# EAGLE design Battery Characterizer (EAGLE 7.7.0)
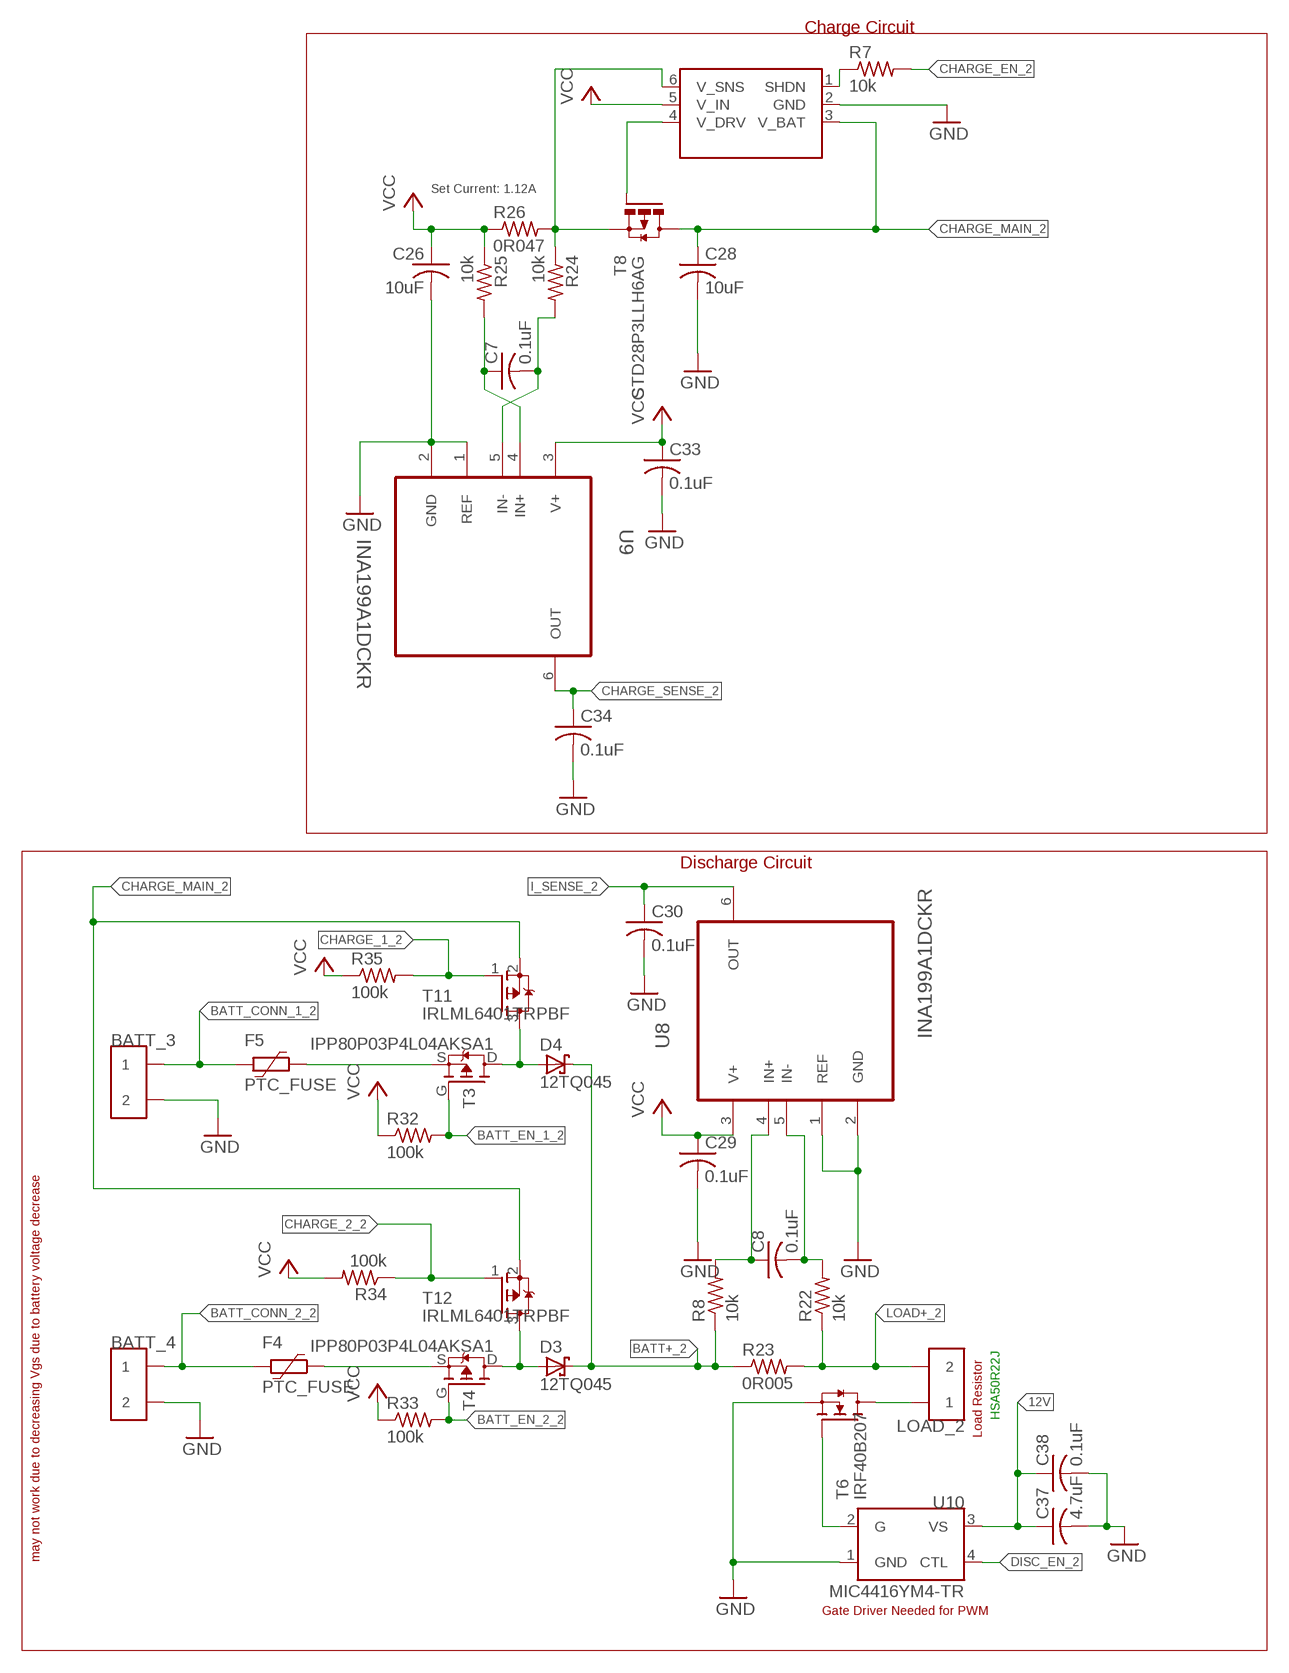
[diagram p0: schematic, sheet 1, part 1 of 2]
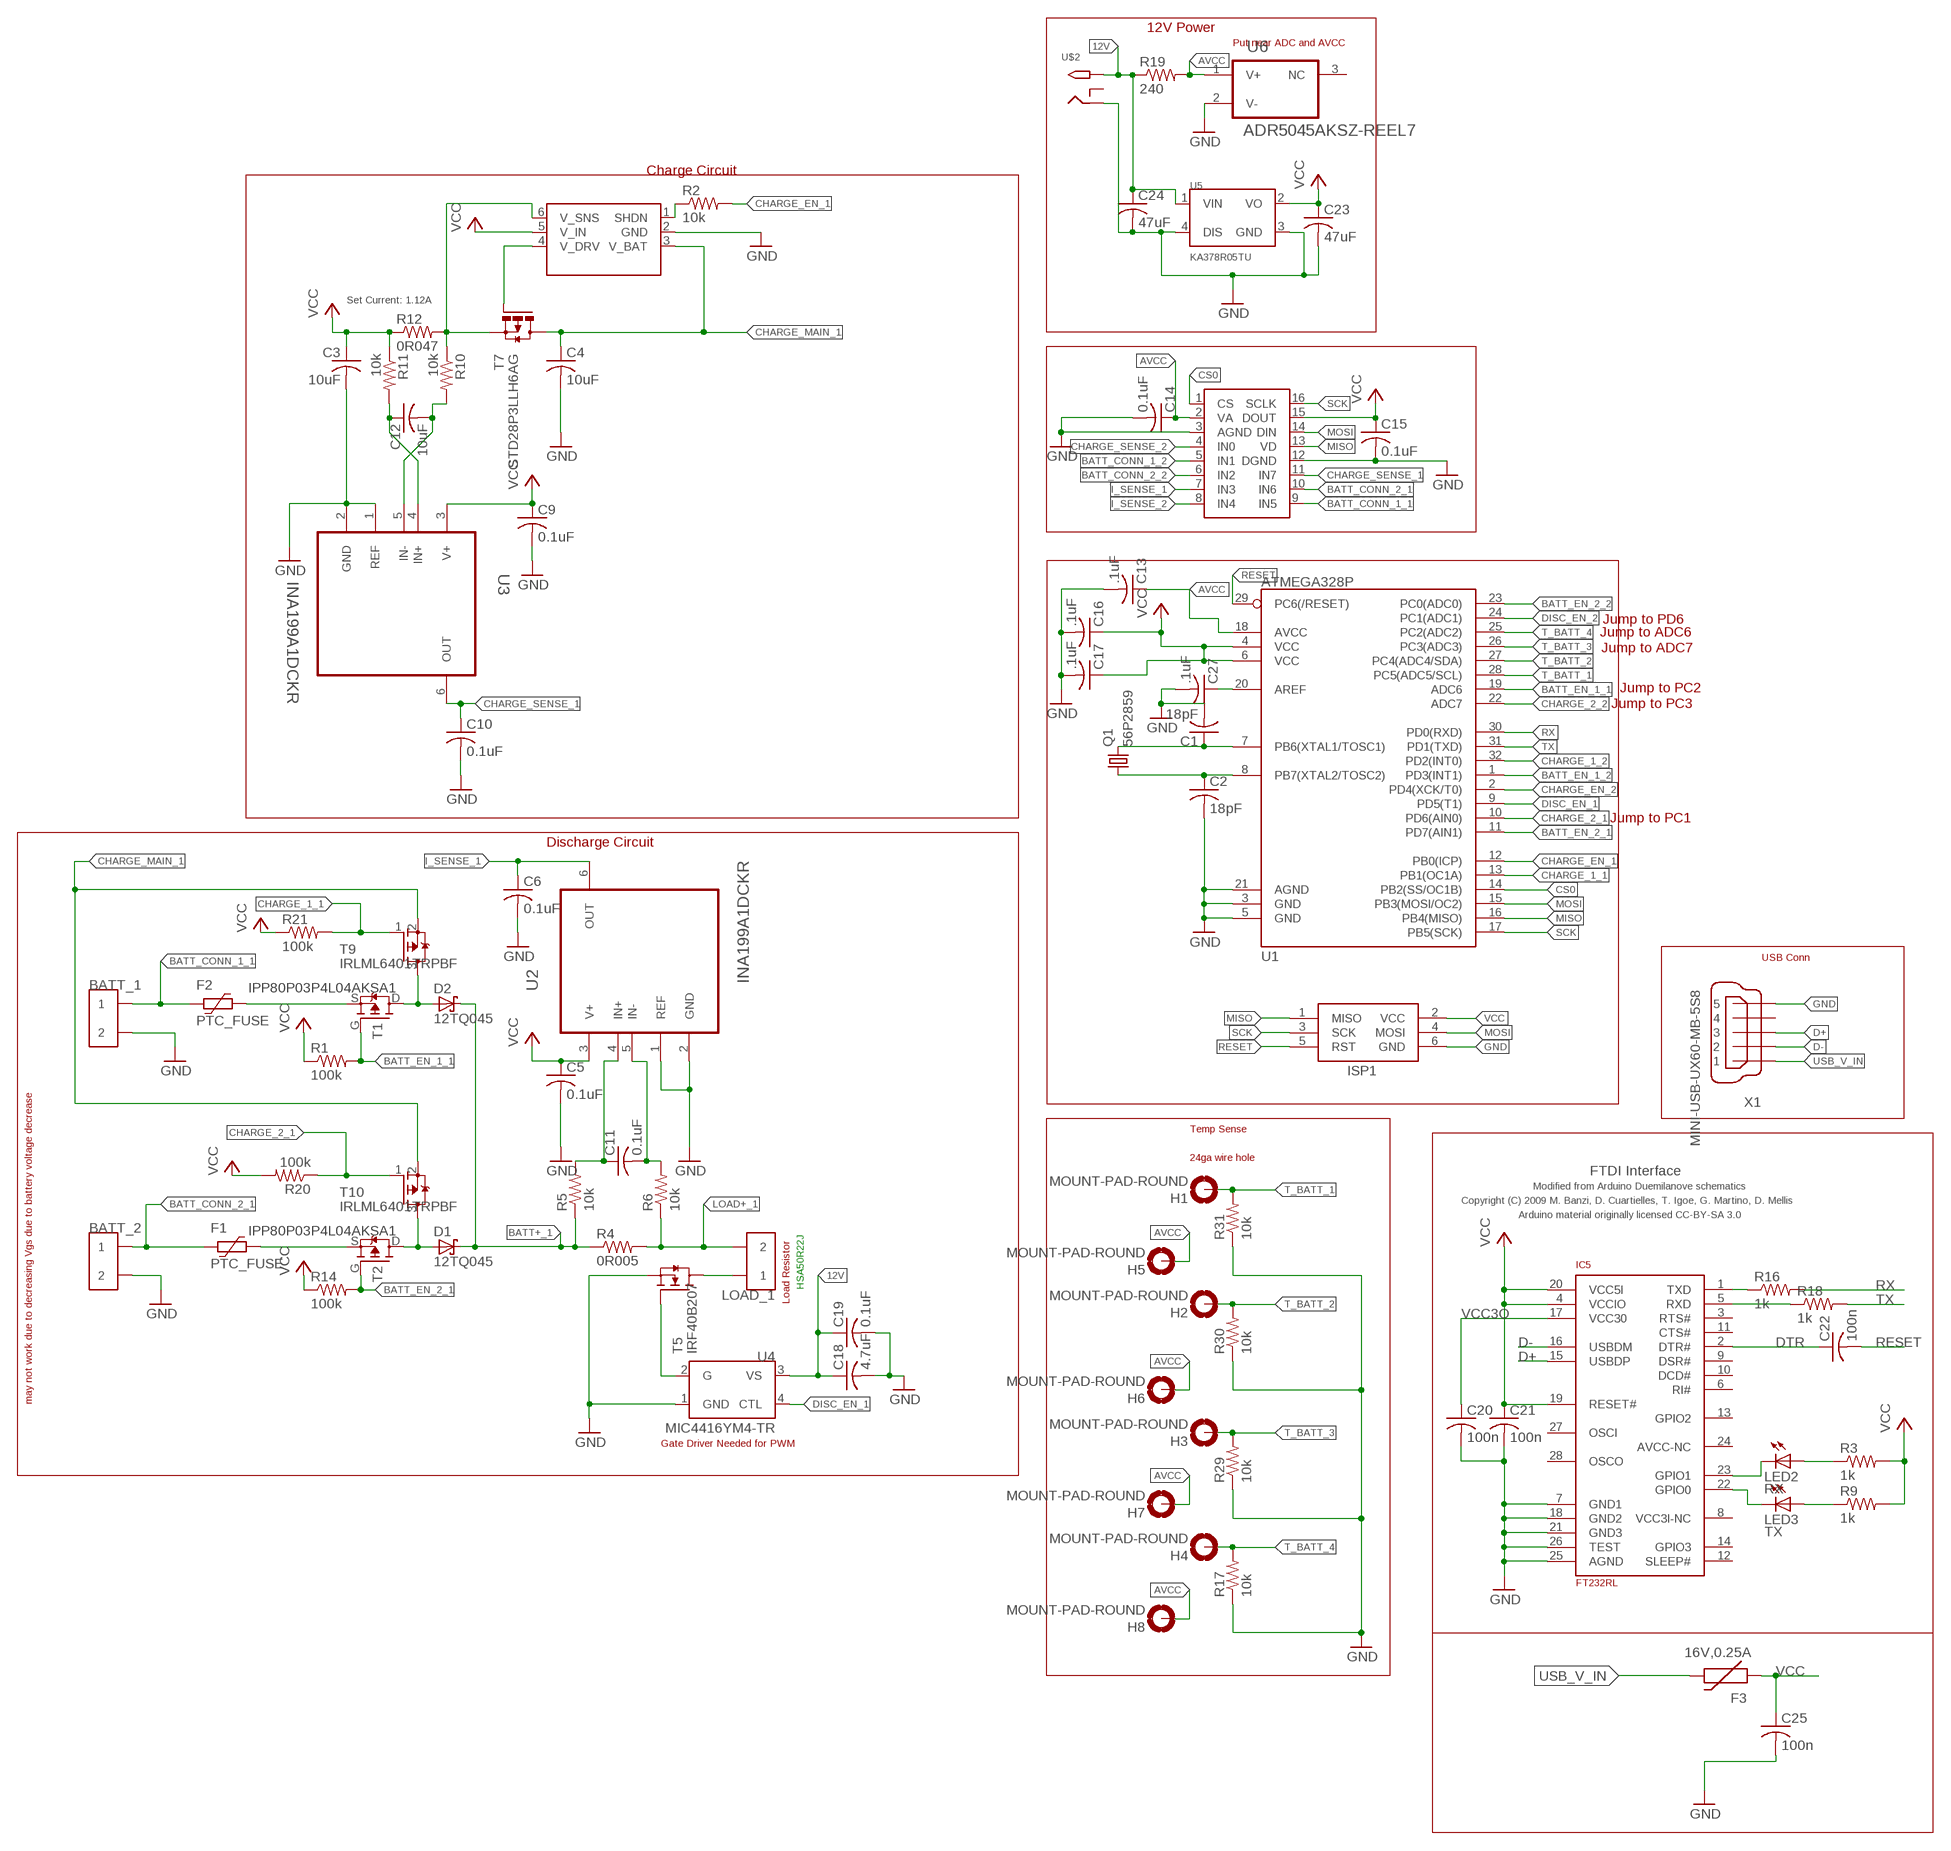
[diagram p1: schematic, sheet 1, part 2 of 2]

## Parts
BATT_1  CONN_2  [CONNECTOR_2]
BATT_2  CONN_2  [CONNECTOR_2]
BATT_3  CONN_2  [CONNECTOR_2]
BATT_4  CONN_2  [CONNECTOR_2]
C1  18pF  C-USC0805  [C0805]
C2  18pF  C-USC0805  [C0805]
C3  10uF  C-USC0603  [C0603]
C4  10uF  C-USC0603  [C0603]
C5  0.1uF  C-USC0603  [C0603]
C6  0.1uF  C-USC0603  [C0603]
C7  0.1uF  C-USC0603  [C0603]
C8  0.1uF  C-USC0603  [C0603]
C9  0.1uF  C-USC0603  [C0603]
C10  0.1uF  C-USC0603  [C0603]
C11  0.1uF  C-USC0603  [C0603]
C12  10uF  C-USC0603  [C0603]
C13  .1uF  C-USC0603  [C0603]
C14  0.1uF  C-USC0603  [C0603]
C15  0.1uF  C-USC0603  [C0603]
C16  .1uF  C-USC0603  [C0603]
C17  .1uF  C-USC0603  [C0603]
C18  4.7uF  C-USC0805  [C0805]
C19  0.1uF  C-USC0603  [C0603]
C20  100n  C-USC0805  [C0805]
C21  100n  C-USC0805  [C0805]
C22  100n  C-USC0805  [C0805]
C23  47uF  C-USC0805  [C0805]
C24  47uF  C-USC0805  [C0805]
C25  100n  C-USC0805  [C0805]
C26  10uF  C-USC0603  [C0603]
C27  .1uF  C-USC0603  [C0603]
C28  10uF  C-USC0603  [C0603]
C29  0.1uF  C-USC0603  [C0603]
C30  0.1uF  C-USC0603  [C0603]
C33  0.1uF  C-USC0603  [C0603]
C34  0.1uF  C-USC0603  [C0603]
C37  4.7uF  C-USC0805  [C0805]
C38  0.1uF  C-USC0603  [C0603]
D1  12TQ045  [TO220-2]
D2  12TQ045  [TO220-2]
D3  12TQ045  [TO220-2]
D4  12TQ045  [TO220-2]
F1  PTC_FUSE  [RGEF1100]
F2  PTC_FUSE  [RGEF1100]
F3  16V,0.25A  PTCSMD  [PTC-1206]
F4  PTC_FUSE  [RGEF1100]
F5  PTC_FUSE  [RGEF1100]
H1  MOUNT-PAD-ROUND  [032-PAD]
H2  MOUNT-PAD-ROUND  [032-PAD]
H3  MOUNT-PAD-ROUND  [032-PAD]
H4  MOUNT-PAD-ROUND  [032-PAD]
H5  MOUNT-PAD-ROUND  [032-PAD]
H6  MOUNT-PAD-ROUND  [032-PAD]
H7  MOUNT-PAD-ROUND  [032-PAD]
H8  MOUNT-PAD-ROUND  [032-PAD]
IC5  FT232RL  [SSOP28]
ISP1  AVRISP-6  [AVRISP]
LED2  RX  LEDCHIPLED_0805  [CHIPLED_0805]
LED3  TX  LEDCHIPLED_0805  [CHIPLED_0805]
LOAD_1  CONN_2  [CONNECTOR_2]
LOAD_2  CONN_2  [CONNECTOR_2]
PC1  MCP73826  [SOT23-6]
PC2  MCP73826  [SOT23-6]
Q1  56P2859  CRYSTALSMD  [HC49UP]
R1  100k  R-US_M0805  [M0805]
R2  10k  R-US_R0603  [R0603]
R3  1k  R-US_R0805  [R0805]
R4  0R005  WSL3637  [R-3637]
R5  10k  R-US_R0603  [R0603]
R6  10k  R-US_R0603  [R0603]
R7  10k  R-US_R0603  [R0603]
R8  10k  R-US_R0603  [R0603]
R9  1k  R-US_R0805  [R0805]
R10  10k  R-US_R0603  [R0603]
R11  10k  R-US_R0603  [R0603]
R12  0R047  R-US_M1206  [M1206]
R14  100k  R-US_M0805  [M0805]
R16  1k  R-US_R0805  [R0805]
R17  10k  R-US_R0603  [R0603]
R18  1k  R-US_R0805  [R0805]
R19  240  R-US_R0603  [R0603]
R20  100k  R-US_M0805  [M0805]
R21  100k  R-US_M0805  [M0805]
R22  10k  R-US_R0603  [R0603]
R23  0R005  WSL3637  [R-3637]
R24  10k  R-US_R0603  [R0603]
R25  10k  R-US_R0603  [R0603]
R26  0R047  R-US_M1206  [M1206]
R29  10k  R-US_R0603  [R0603]
R30  10k  R-US_R0603  [R0603]
R31  10k  R-US_R0603  [R0603]
R32  100k  R-US_M0805  [M0805]
R33  100k  R-US_M0805  [M0805]
R34  100k  R-US_M0805  [M0805]
R35  100k  R-US_M0805  [M0805]
T1  IPP80P03P4L04AKSA1  [TO220-3]
T2  IPP80P03P4L04AKSA1  [TO220-3]
T3  IPP80P03P4L04AKSA1  [TO220-3]
T4  IPP80P03P4L04AKSA1  [TO220-3]
T5  IRF40B207  [TO220-3]
T6  IRF40B207  [TO220-3]
T7  STD28P3LLH6AG  [D2-PAK]
T8  STD28P3LLH6AG  [D2-PAK]
T9  IRLML6401TRPBF  [SOT95P237X112-3N]
T10  IRLML6401TRPBF  [SOT95P237X112-3N]
T11  IRLML6401TRPBF  [SOT95P237X112-3N]
T12  IRLML6401TRPBF  [SOT95P237X112-3N]
U1  ATMEGA328P  ATMEGA328_SMT  [TQFP32-08]
U2  INA199A1DCKR  [SOT65P210X110-6N]
U3  INA199A1DCKR  [SOT65P210X110-6N]
U4  MIC4416YM4-TR  [4-SOT_143]
U5  KA378R05TU  [TO-220-4]
U6  ADR5045AKSZ-REEL7  ADR5041BRTZ-R2  [SOT95P237X112-3N]
U8  INA199A1DCKR  [SOT65P210X110-6N]
U9  INA199A1DCKR  [SOT65P210X110-6N]
U10  MIC4416YM4-TR  [4-SOT_143]
U$2  2.1MMJACKTHM  [PJ-102A]
U$7  ADC128S022CIMTX/NOPB  [TSSOP16]
X1  MINI-USB-UX60-MB-5S8  [UX60-MB-5S8]

## Nets
12V: C18.1 C19.1 C24.1 C37.1 C38.1 R19.1 U4.3(VS) U5.1(VIN) U10.3(VS) U$2.TIP
AREF: C27.1 U1.20(AREF)
AVCC: C13.1 C14.1 H5.1(MOUNT) H6.1(MOUNT) H7.1(MOUNT) H8.1(MOUNT) R19.2 U1.18(AVCC) U6.1(V+) U$7.2(VA)
BATT+_1: D1.C D2.C R4.1 R4.2 R5.1
BATT+_2: D3.C D4.C R8.1 R23.1 R23.2
BATT_CONN_1_1: BATT_1.1 BATT_1.2 F2.P$2 U$7.9(IN5)
BATT_CONN_1_2: BATT_3.1 BATT_3.2 F5.P$2 U$7.5(IN1)
BATT_CONN_2_1: BATT_2.1 BATT_2.2 F1.P$2 U$7.10(IN6)
BATT_CONN_2_2: BATT_4.1 BATT_4.2 F4.P$2 U$7.6(IN2)
BATT_EN_1_1: R1.2 T1.G U1.19(ADC6)
BATT_EN_1_2: R32.2 T3.G U1.1(PD3(INT1))
BATT_EN_2_1: R14.2 T2.G U1.11(PD7(AIN1))
BATT_EN_2_2: R33.2 T4.G U1.23(PC0(ADC0))
CHARGE_1_1: R21.2 T9.1(G) U1.13(PB1(OC1A))
CHARGE_1_2: R35.2 T11.1(G) U1.32(PD2(INT0))
CHARGE_2_1: R20.1 T10.1(G) U1.10(PD6(AIN0))
CHARGE_2_2: R34.1 T12.1(G) U1.22(ADC7)
CHARGE_EN_1: R2.2 U1.12(PB0(ICP))
CHARGE_EN_2: R7.2 U1.2(PD4(XCK/T0))
CHARGE_MAIN_1: C4.1 PC1.3(V_BAT) T7.2(D) T7.P$1(D) T7.P$2(D) T7.P$3(D) T7.P$4(D) T7.P$5(D) T7.P$6(D) T7.P$7(D) T7.P$8(D) T7.P$9(D) T7.P$10(D) T7.P$11(D) T7.P$12(D) T7.P$13(D) T7.P$14(D) T7.P$15(D) T7.P$16(D) T7.P$17(D) T7.P$18(D) T7.P$19(D) T7.P$20(D) T7.P$21(D) T7.P$22(D) T7.P$23(D) T7.P$24(D) T7.P$25(D) T7.P$26(D) T7.P$27(D) T7.P$28(D) T7.P$29(D) T7.P$30(D) T9.2(S) T10.2(S)
CHARGE_MAIN_2: C28.1 PC2.3(V_BAT) T8.2(D) T8.P$1(D) T8.P$2(D) T8.P$3(D) T8.P$4(D) T8.P$5(D) T8.P$6(D) T8.P$7(D) T8.P$8(D) T8.P$9(D) T8.P$10(D) T8.P$11(D) T8.P$12(D) T8.P$13(D) T8.P$14(D) T8.P$15(D) T8.P$16(D) T8.P$17(D) T8.P$18(D) T8.P$19(D) T8.P$20(D) T8.P$21(D) T8.P$22(D) T8.P$23(D) T8.P$24(D) T8.P$25(D) T8.P$26(D) T8.P$27(D) T8.P$28(D) T8.P$29(D) T8.P$30(D) T11.2(S) T12.2(S)
CHARGE_SENSE_1: C10.1 U3.6(OUT) U$7.11(IN7)
CHARGE_SENSE_2: C34.1 U9.6(OUT) U$7.4(IN0)
CS0: U1.14(PB2(SS/OC1B)) U$7.1(CS)
D+: IC5.15(USBDP) X1.3
D-: IC5.16(USBDM) X1.2
DISC_EN_1: U1.9(PD5(T1)) U4.4(CTL)
DISC_EN_2: U1.24(PC1(ADC1)) U10.4(CTL)
DISC_GATE_1: T5.G U4.2(G)
DISC_GATE_2: T6.G U10.2(G)
DISC_INV_1: C11.2 R6.2 U2.5(IN-)
DISC_INV_2: C8.2 R22.2 U8.5(IN-)
DISC_NON_INV_1: C11.1 R5.2 U2.4(IN+)
DISC_NON_INV_2: C8.1 R8.2 U8.4(IN+)
DTR: C22.1 IC5.2(DTR#)
FUSE_OUT_1_1: F2.P$1 T1.S
FUSE_OUT_1_2: F5.P$1 T3.S
FUSE_OUT_2_1: F1.P$1 T2.S
FUSE_OUT_2_2: F4.P$1 T4.S
GATE_1: PC1.4(V_DRV) T7.1(G)
GATE_2: PC2.4(V_DRV) T8.1(G)
GND: BATT_1.3 BATT_1.4 BATT_2.3 BATT_2.4 BATT_3.3 BATT_3.4 BATT_4.3 BATT_4.4 C1.2 C2.2 C3.2 C4.2 C5.2 C6.2 C9.2 C10.2 C13.2 C14.2 C15.2 C16.2 C17.2 C18.2 C19.2 C20.2 C21.2 C23.2 C24.2 C25.2 C26.2 C27.2 C28.2 C29.2 C30.2 C33.2 C34.2 C37.2 C38.2 IC5.7(GND1) IC5.18(GND2) IC5.21(GND3) IC5.25(AGND) IC5.26(TEST) ISP1.6(GND) PC1.2(GND) PC2.2(GND) R17.1 R29.1 R30.1 R31.1 T5.S T6.S U1.3(GND) U1.5(GND) U1.21(AGND) U2.1(REF) U2.2(GND) U3.1(REF) U3.2(GND) U4.1(GND) U5.3(GND) U5.4(DIS) U6.2(V-) U8.1(REF) U8.2(GND) U9.1(REF) U9.2(GND) U10.1(GND) U$2.RING U$7.3(AGND) U$7.12(DGND) X1.5 X1.M1 X1.M2 X1.M3 X1.M4
I_SENSE_1: C6.1 U2.6(OUT) U$7.7(IN3)
I_SENSE_2: C30.1 U8.6(OUT) U$7.8(IN4)
INV_1: C12.2 R10.2 U3.5(IN-)
INV_2: C7.2 R24.2 U9.5(IN-)
LOAD+_1: LOAD_1.3 LOAD_1.4 R4.3 R4.4 R6.1
LOAD+_2: LOAD_2.3 LOAD_2.4 R22.1 R23.3 R23.4
M8RXD: IC5.1(TXD) R16.1
M8TXD: IC5.5(RXD) R18.1
MISO: ISP1.1(MISO) U1.16(PB4(MISO)) U$7.13(VD)
MOSI: ISP1.4(MOSI) U1.15(PB3(MOSI/OC2)) U$7.14(DIN)
N$32: IC5.23(GPIO1) LED2.C
N$34: IC5.22(GPIO0) LED3.C
N$35: LED2.A R3.1
N$36: LED3.A R9.1
NMOS_IN_1: LOAD_1.1 LOAD_1.2 T5.D
NMOS_IN_2: LOAD_2.1 LOAD_2.2 T6.D
NON_INV_1: C12.1 R11.2 U3.4(IN+)
NON_INV_2: C7.1 R25.2 U9.4(IN+)
PMOS_OUT_1_1: D2.A T1.D T9.3(D)
PMOS_OUT_1_2: D4.A T3.D T11.3(D)
PMOS_OUT_2_1: D1.A T2.D T10.3(D)
PMOS_OUT_2_2: D3.A T4.D T12.3(D)
RESET: C22.2 ISP1.5(RST) U1.29(PC6(/RESET))
RX: R16.2 U1.30(PD0(RXD))
SCK: ISP1.3(SCK) U1.17(PB5(SCK)) U$7.16(SCLK)
SHDN_1: PC1.1(SHDN) R2.1
SHDN_2: PC2.1(SHDN) R7.1
T_BATT_1: H1.1(MOUNT) R31.2 U1.28(PC5(ADC5/SCL))
T_BATT_2: H2.1(MOUNT) R30.2 U1.27(PC4(ADC4/SDA))
T_BATT_3: H3.1(MOUNT) R29.2 U1.26(PC3(ADC3))
T_BATT_4: H4.1(MOUNT) R17.2 U1.25(PC2(ADC2))
TX: R18.2 U1.31(PD1(TXD))
USB_V_IN: F3.2 X1.1
V_SNS_1: PC1.6(V_SNS) R10.1 R12.2 T7.3(S)
V_SNS_2: PC2.6(V_SNS) R24.1 R26.2 T8.3(S)
VCC: C3.1 C5.1 C9.1 C15.1 C16.1 C17.1 C21.1 C23.1 C25.1 C26.1 C29.1 C33.1 F3.1 IC5.4(VCCIO) IC5.19(RESET#) IC5.20(VCC5I) ISP1.2(VCC) PC1.5(V_IN) PC2.5(V_IN) R1.1 R3.2 R9.2 R11.1 R12.1 R14.1 R20.2 R21.1 R25.1 R26.1 R32.1 R33.1 R34.2 R35.1 U1.4(VCC) U1.6(VCC) U2.3(V+) U3.3(V+) U5.2(VO) U8.3(V+) U9.3(V+) U$7.15(DOUT)
VCC3O: C20.1 IC5.17(VCC30)
XTAL1: C1.1 Q1.2 U1.7(PB6(XTAL1/TOSC1))
XTAL2: C2.1 Q1.1 U1.8(PB7(XTAL2/TOSC2))
Unconnected: IC5.3(RTS#) IC5.6(RI#) IC5.8(VCC3I-NC) IC5.9(DSR#) IC5.10(DCD#) IC5.11(CTS#) IC5.12(SLEEP#) IC5.13(GPIO2) IC5.14(GPIO3) IC5.24(AVCC-NC) IC5.27(OSCI) IC5.28(OSCO) U6.3(NC) U$2.RING_SW X1.4

## Notes on the sheet
- 12V Power
- Put near ADC and AVCC
- Charge Circuit | Charge Circuit
- Set Current: 1.12A | Set Current: 1.12A
- Jump to PD6
- Jump to ADC6
- Jump to ADC7
- Jump to PC2
- Jump to PC3
- Jump to PC1
- Discharge Circuit | Discharge Circuit
- USB Conn
- Temp Sense
- 24ga wire hole
- FTDI Interface
- Modified from Arduino Duemilanove schematics
- Copyright (C) 2009 M. Banzi, D. Cuartielles, T. Igoe, G. Martino, D. Mellis
- Arduino material originally licensed CC-BY-SA 3.0
- HSA50R22J | HSA50R22J
- Load Resistor | Load Resistor
- may not work due to decreasing Vgs due to battery voltage decrease | may not work due to decreasing Vgs due to battery voltage decrease
- Gate Driver Needed for PWM | Gate Driver Needed for PWM

## Library data of the parts
BATT_1-BATT_4 LOAD_1 LOAD_2 = formula electric:CONN_2; PN: A104554-ND
C1-C22 C25-C30 C33 C34 C37 C38 = rcl:C-US: CAPACITOR, American symbol
C23 = resistor:C-US: CAPACITOR, American symbol; PN: GRM21BR60J476ME15L
C24 = rcl:C-US: CAPACITOR, American symbol; PN: GRM21BR60J476ME15L
D1-D4 = SMC_Diode:12TQ045: Schottky Diode
F1 F2 F4 F5 = LittleFuse:PTC_FUSE: Polyfuse Resettable PTC Source: http://www.littelfuse.com/products/resettable-ptcs.aspx
F3 = SparkFun:PTC: Resettable Fuse PTC Resettable Fuse. Spark Fun Electronics SKU : COM-08357
H1-H8 = holes:MOUNT-PAD-ROUND: MOUNTING PAD, round
IC5 = SmartPrj:FT232RL
ISP1 = adafruit:AVRISP: AVR ISP HEADER Standard 6 pin header for AVR programming
LED2 LED3 = led:LED: LED OSRAM: - CHIPLED LG R971, LG N971, LY N971, LG Q971, LY Q971, LO R971, LY R971 LH N974, LH R974 LS Q976, LO Q976, LY Q976 LO Q996 - Hyper CHIPLED LW Q18S LB Q993, LB Q99A, LB R99A - SideLED LS A670, LO A670, LY A670, LG A670, LP A670 LB A673, LV A673, LT A673, LW A673 LH A674 LY A675 LS A676, LA A676, LO A676, LY A676, LW A676 LS A679, LY A679, LG A679 - Hyper Micro SIDELED® LS Y876, LA Y876, LO Y876, LY Y876 LT Y87S - SmartLED LW L88C, LW L88S LB L89C, LB L89S, LG L890 LS L89K, LO L89K, LY L89K LS L896, LA L896, LO L896, LY L896 - TOPLED LS T670, LO T670, LY T670, LG T670, LP T670 LSG T670, LSP T670, LSY T670, LOP T670, LYG T670 LG T671, LOG T671, LSG T671 LB T673, LV T673, LT T673, LW T673 LH T674 LS T676, LA T676, LO T676, LY T676, LB T676, LH T676, LSB T676, LW T676 LB T67C, LV T67C, LT T67C, LS T67K, LO T67K, LY T67K, LW E67C LS E67B, LA E67B, LO E67B, LY E67B, LB E67C, LV E67C, LT E67C LW T67C LS T679, LY T679, LG T679 LS T770, LO T770, LY T770, LG T770, LP T770 LB T773, LV T773, LT T773, LW T773 LH T774 LS E675, LA E675, LY E675, LS T675 LS T776, LA T776, LO T776, LY T776, LB T776 LHGB T686 LT T68C, LB T68C - Hyper Mini TOPLED® LB M676 - Mini TOPLED Santana® LG M470 LS M47K, LO M47K, LY M47K Source: http://www.osram.convergy.de LUXEON: - LUMILED® LXK2-PW12-R00, LXK2-PW12-S00, LXK2-PW14-U00, LXK2-PW14-V00 LXK2-PM12-R00, LXK2-PM12-S00, LXK2-PM14-U00 LXK2-PE12-Q00, LXK2-PE12-R00, LXK2-PE12-S00, LXK2-PE14-T00, LXK2-PE14-U00 LXK2-PB12-K00, LXK2-PB12-L00, LXK2-PB12-M00, LXK2-PB14-N00, LXK2-PB14-P00, LXK2-PB14-Q00 LXK2-PR12-L00, LXK2-PR12-M00, LXK2-PR14-Q00, LXK2-PR14-R00 LXK2-PD12-Q00, LXK2-PD12-R00, LXK2-PD12-S00 LXK2-PH12-R00, LXK2-PH12-S00 LXK2-PL12-P00, LXK2-PL12-Q00, LXK2-PL12-R00 Source: www.luxeon.com KINGBRIGHT: KA-3528ASYC Source: www.kingbright.com
PC1 PC2 = microchip:MCP73826
Q1 = SparkFun-FreqCtrl:CRYSTAL: Various standard crystals. Proven footprints. Spark Fun Electronics SKU : COM-00534
R1 R14 R20 R21 R32-R35 = rcl:R-US_: RESISTOR, American symbol; PN: RL1220T-R039
R2 R5-R8 R10 R11 R17 R22 R24 R25 R29-R31 = resistor:R-US_: RESISTOR, American symbol; PN: RC0603FR-0710KL
R3 R9 R16 R18 = rcl:R-US_: RESISTOR, American symbol
R4 R23 = vishay:WSL3637; PN: KRL1632E-M-R005-G-T5
R12 R26 = resistor:R-US_: RESISTOR, American symbol; PN: MCR18EZHFSR047
R19 = resistor:R-US_: RESISTOR, American symbol; PN: RC0603JR-07240RL
T1-T4 = infineon:IPP80P03P4L04AKSA1
T5 T6 = infineon:IRF40B207: N Channel Power Mosfet
T7 T8 = st-microelectronics:STD28P3LLH6AG
T9-T12 = International_Rectifier_By_element14_Batch_1:IRLML6401TRPBF
U1 = SparkFun-DigitalIC:ATMEGA328_SMT: 32-Pin Atmega328 part Commonly used on Arduino compatible boards Available in QFP and QFN packages TQFP is IC-09069 QFN is non-stock; PROD_ID: IC-09069
U2 U3 U8 U9 = Texas Instruments_By_element14_Batch_1:INA199A1DCKR: CURRENT SHUNT MONITOR; MPN: INA199A1DCKR; OC_FARNELL: -; OC_NEWARK: 74R6382; PACKAGE: SC70-6; SUPPLIER: Texas Instruments
U4 U10 = Microchip_By_element14_Batch_1:MIC4416YM4-TR: Gate Driver
U5 = Fairchild_By_element14_Batch_1:KA378R05TU: 5V 3A LDO, Digikey PN - KA378R05TU-ND
U6 = Analog Devices_By_element14_Batch_1:ADR5041BRTZ-R2: Precision Micropower Shunt Mode Voltage References; MPN: ADR5045AKSZ-REEL7; OC_FARNELL: 1814352; OC_NEWARK: 34M4886; PACKAGE: SOT-23-3; SUPPLIER: Analog Devices
U$2 = adafruit:2.1MMJACK: 2.1mm x 5.5mm THM DC jack with internal switch. Digikey part #PJ-102A, 4UCON part #05537 2.1mm x 5.5mm SMT DC jack with internal switch. Digikey part #PJ-002A-SMT, 4UCON part #03267 By microbuilder.eu & adafruit.com
U$7 = texas:ADC128S022CIMTX/NOPB
X1 = con-hirose:MINI-USB-: MINI USB Connector Source: http://www.hirose.co.jp/cataloge_hp/e24000019.pdf; OC_FARNELL: unknown; OC_NEWARK: unknown

## Board
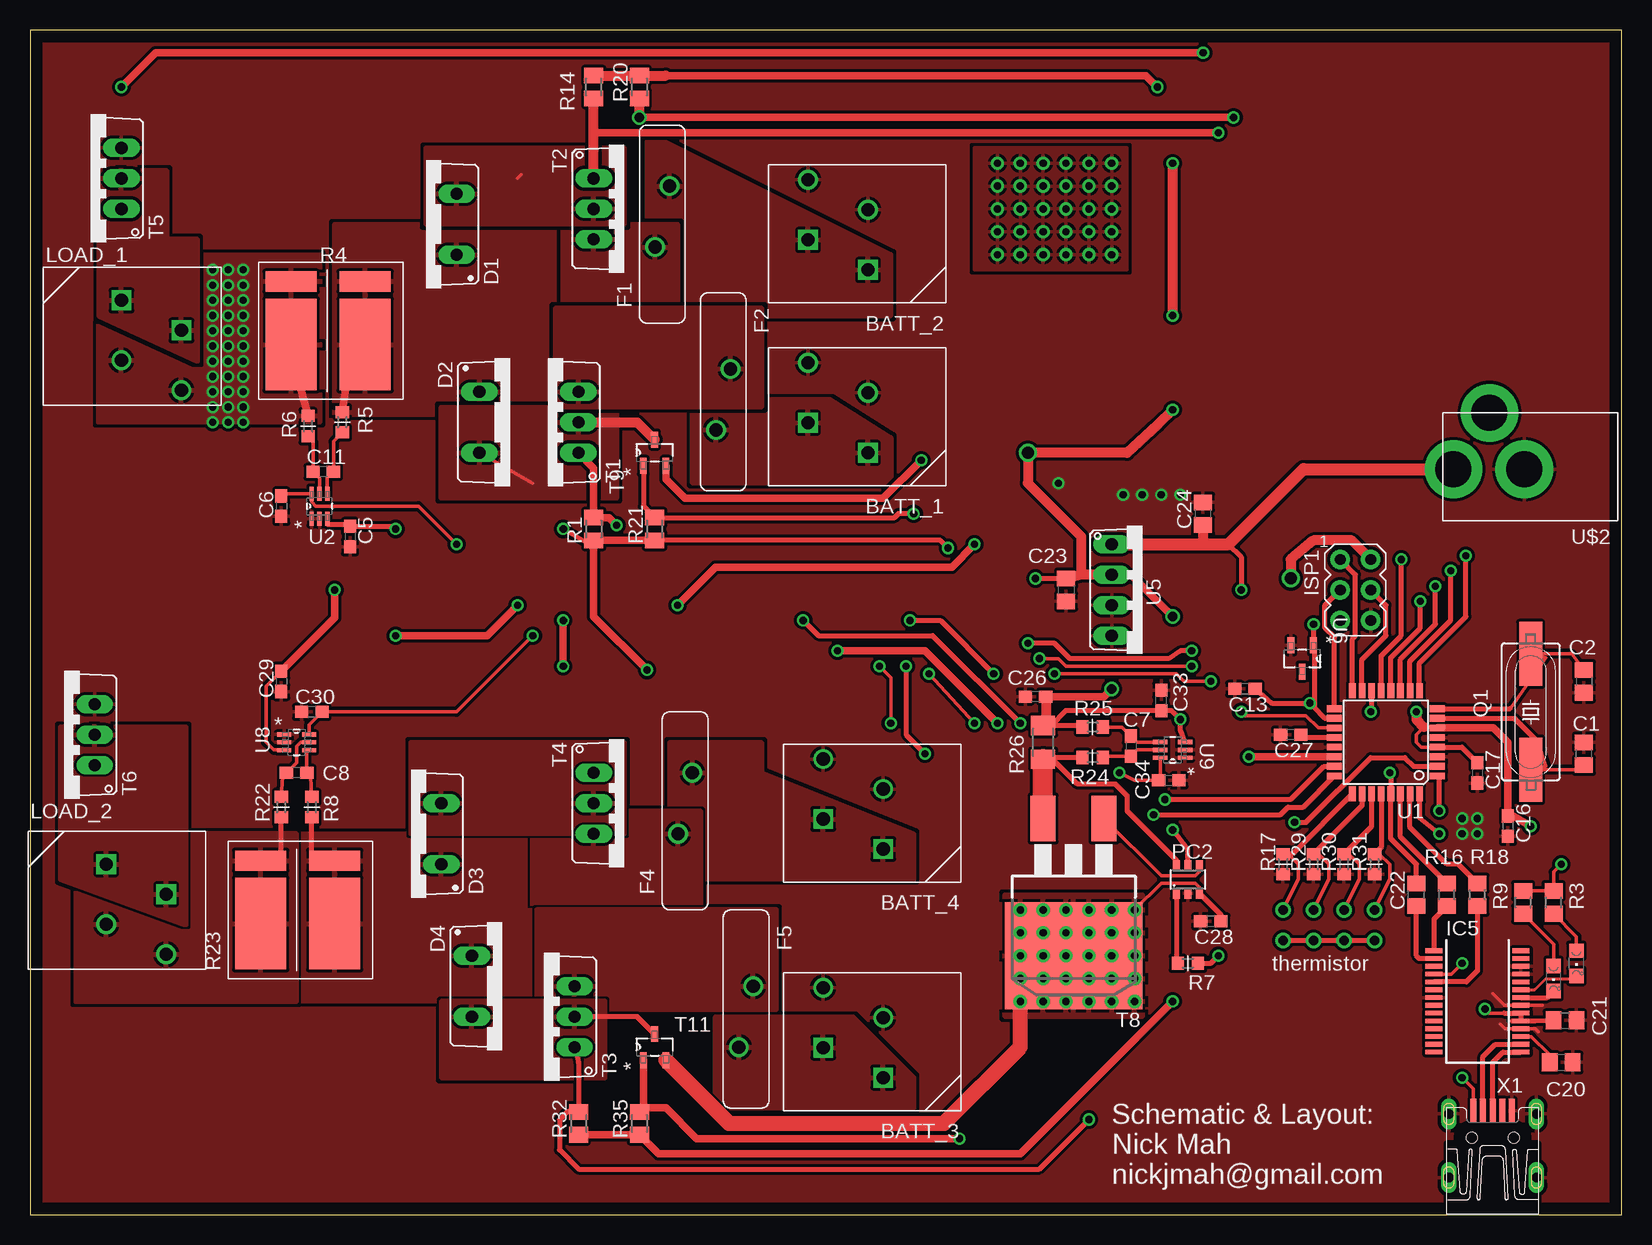
[diagram p2: board, top side]
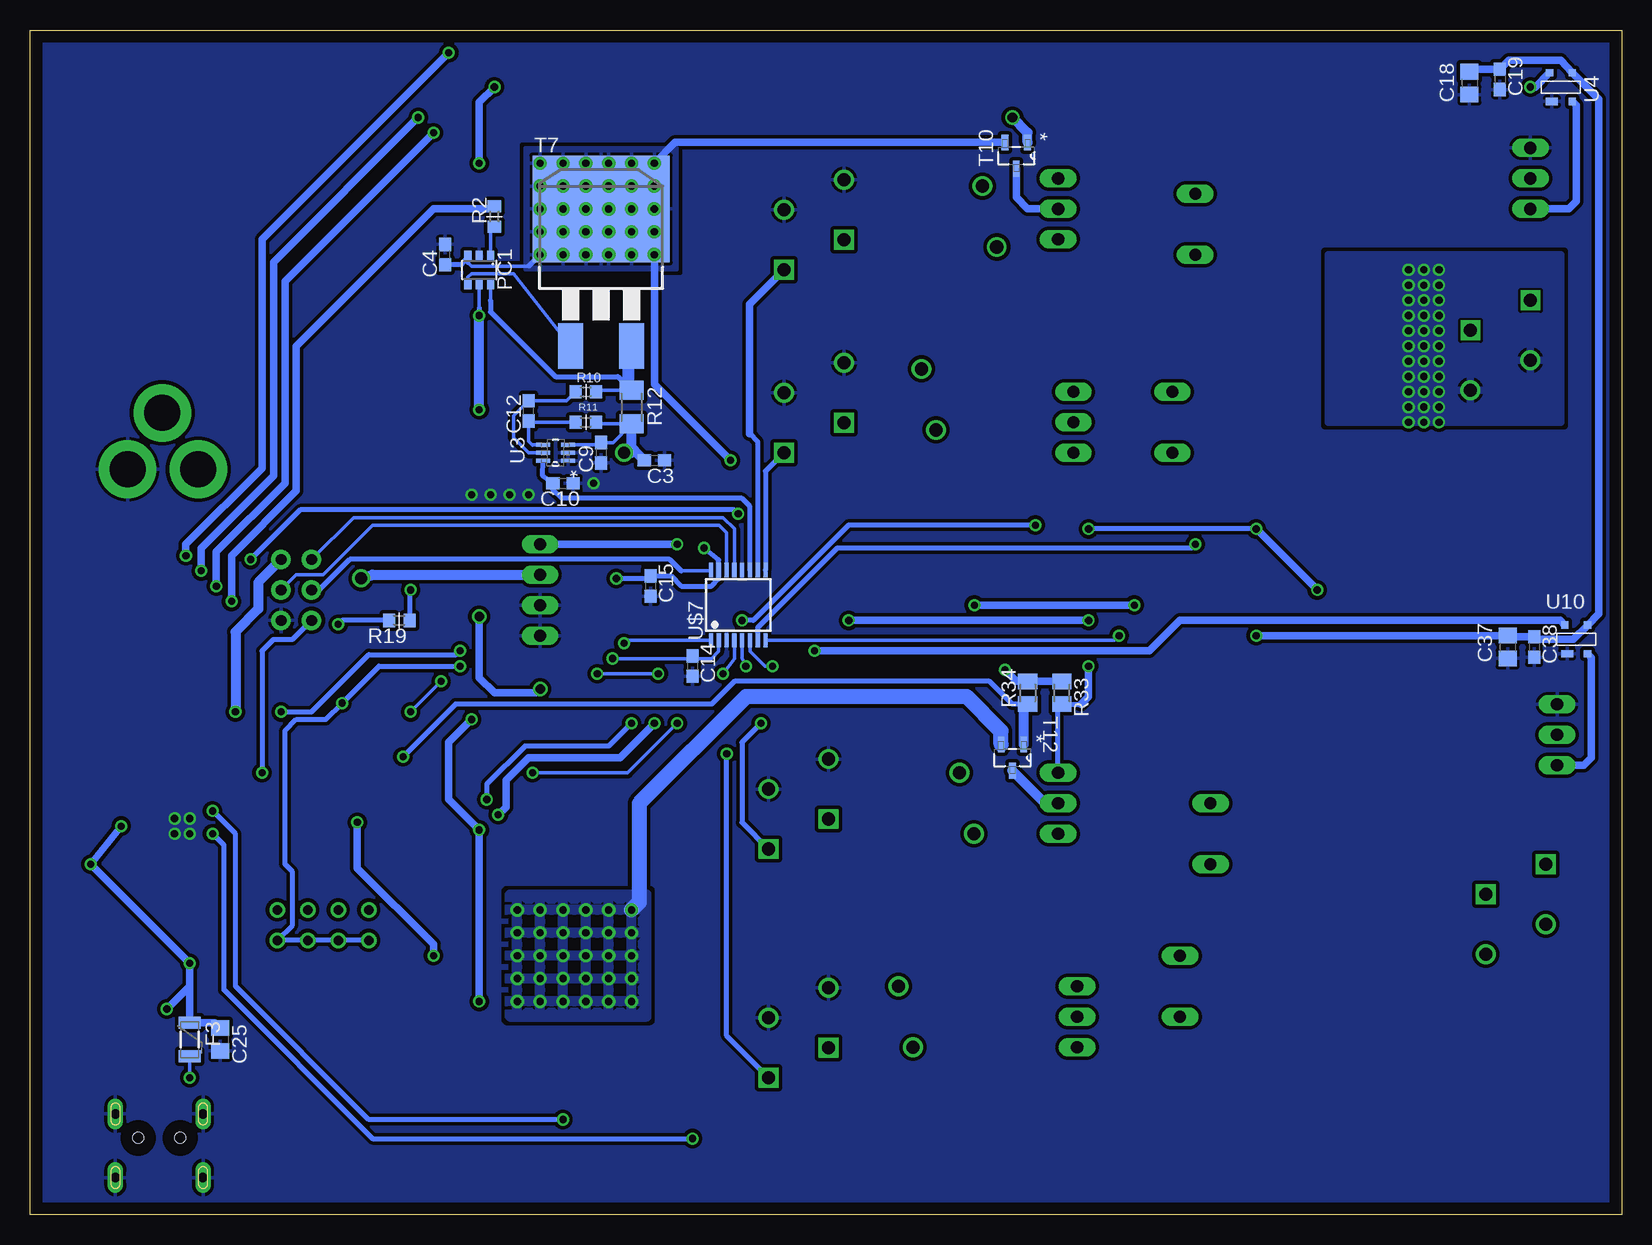
[diagram p3: board, bottom side, seen from below]

Size 132.69 x 98.73 mm. Coordinates in mm from the lower left corner, seen from the top.
Outline: 0,0 132.69,0 132.69,98.73 0,98.73 0,0
Copper layers (1*16): Top 0.035mm / dielectric 1.5mm / Bottom 0.035mm
Design rules "default *": minimum track width 10mil, minimum drill 10mil, track to track 8mil, track to pad 8mil, pad to pad 8mil, via to via 8mil, smd to smd 8mil, copper to edge 40mil, drill to drill 8mil, minimum pad ring 10mil, minimum via ring 8mil, stop-mask expansion 4mil, vias tented up to drill 0mil, thermal gap 10mil

### Footprints (pad centres in the part's own frame; a part is rotated, then mirrored left to right if it is on the bottom)
CONNECTOR_2 = drill 1.1 square: 1 0,0; 2 2.5,5 | drill 1.1: 3 5,0; 4 7.5,5
C0805 = smd 1.3 x 1.5: 1 -0.95,0; 2 0.95,0
C0603 = smd 1.1 x 1: 1 -0.85,0; 2 0.85,0
TO220-2 = drill 1.016 long: A 2.54,0; C -2.54,0
RGEF1100 = drill 1.1: P$1 -2.54,0.6; P$2 2.54,-0.6
PTC-1206 = smd 1 x 1.8: 1 -1.4,0; 2 1.4,0
032-PAD = drill 0.8: 1 0,0
SSOP28 = smd 0.381 x 1.499: 1 -4.225,-3.625; 2 -3.575,-3.625; 3 -2.925,-3.625; 4 -2.275,-3.625; 5 -1.625,-3.625; 6 -0.975,-3.625; 7 -0.325,-3.625; 8 0.325,-3.625; 9 0.975,-3.625; 10 1.625,-3.625; 11 2.275,-3.625; 12 2.925,-3.625; 13 3.575,-3.625; 14 4.225,-3.625; 15 4.225,3.625; 16 3.575,3.625; 17 2.925,3.625; 18 2.275,3.625; 19 1.625,3.625; 20 0.975,3.625; 21 0.325,3.625; 22 -0.325,3.625; 23 -0.975,3.625; 24 -1.625,3.625; 25 -2.275,3.625; 26 -2.925,3.625; 27 -3.575,3.625; 28 -4.225,3.625
AVRISP = drill 0.9 pad 1.626: 1 -1.27,2.54; 2 1.27,2.54; 3 -1.27,0; 4 1.27,0; 5 -1.27,-2.54; 6 1.27,-2.54
CHIPLED_0805 = smd 1.2 x 1.2: A 0,-1.05; C 0,1.05
SOT23-6 = smd 0.6 x 0.9: 1 -0.95,-1.15; 2 0,-1.15; 3 0.95,-1.15; 4 0.95,1.15; 5 0,1.15; 6 -0.95,1.15
HC49UP = smd 5.334 x 1.93: 1 -4.826,0; 2 4.826,0
M0805 = smd 1.3 x 1.6: 1 -0.95,0; 2 0.95,0
R0603 = smd 1 x 1.1: 1 -0.85,0; 2 0.85,0
R0805 = smd 1.3 x 1.5: 1 -0.95,0; 2 0.95,0
R-3637 = smd 7.62 x 4.267: 1 -1.143,0; 4 -1.143,6.172 | smd 1.676 x 4.267: 2 4.115,0; 3 4.115,6.172
M1206 = smd 1.6 x 2: 1 -1.4,0; 2 1.4,0
TO220-3 = drill 1.016 long: D 0,0; G -2.54,0; S 2.54,0
D2-PAK = smd 2.083 x 3.81: 1 -2.54,-10.16; 3 2.54,-10.16 | smd 11.43 x 8.89: 2 0,1.27 | drill 0.6: P$1 -5.08,5.08; P$2 -3.175,5.08; P$3 -1.27,5.08; P$4 0.635,5.08; P$5 2.54,5.08; P$6 4.445,5.08; P$7 4.445,3.175; P$8 2.54,3.175; P$9 0.635,3.175; P$10 -1.27,3.175; P$11 -3.175,3.175; P$12 -5.08,3.175; P$13 -5.08,1.27; P$14 -5.08,-0.635; P$15 -5.08,-2.54; P$16 -3.175,-2.54; P$17 -1.27,-2.54; P$18 0.635,-2.54; P$19 2.54,-2.54; P$20 4.445,-2.54; P$21 4.445,-0.635; P$22 4.445,1.27; P$23 2.54,1.27; P$24 0.635,1.27; P$25 -1.27,1.27; P$26 -3.175,1.27; P$27 -3.175,-0.635; P$28 -1.27,-0.635; P$29 0.635,-0.635; P$30 2.54,-0.635
SOT95P237X112-3N = smd 1.321 x 0.559: 1 -1.092,0.94; 2 -1.092,-0.94; 3 1.092,0
TQFP32-08 = smd 1.27 x 0.559: 1 -4.293,2.8; 2 -4.293,2; 3 -4.293,1.2; 4 -4.293,0.4; 5 -4.293,-0.4; 6 -4.293,-1.2; 7 -4.293,-2; 8 -4.293,-2.8; 17 4.293,-2.8; 18 4.293,-2; 19 4.293,-1.2; 20 4.293,-0.4; 21 4.293,0.4; 22 4.293,1.2; 23 4.293,2; 24 4.293,2.8 | smd 0.559 x 1.27: 9 -2.8,-4.293; 10 -2,-4.293; 11 -1.2,-4.293; 12 -0.4,-4.293; 13 0.4,-4.293; 14 1.2,-4.293; 15 2,-4.293; 16 2.8,-4.293; 25 2.8,4.293; 26 2,4.293; 27 1.2,4.293; 28 0.4,4.293; 29 -0.4,4.293; 30 -1.2,4.293; 31 -2,4.293; 32 -2.8,4.293
SOT65P210X110-6N = smd 1.168 x 0.356: 1 -1.041,0.66; 2 -1.041,0; 3 -1.041,-0.66; 4 1.041,-0.66; 5 1.041,0; 6 1.041,0.66
4-SOT_143 = smd 1 x 0.6: 1 -0.75,-1.2 | smd 0.6 x 0.6: 2 0.95,-1.2; 3 0.95,1.2; 4 -0.95,1.2
TO-220-4 = drill 1.016 long: 1 -3.81,0; 2 -1.27,0; 3 1.27,0; 4 3.81,0
PJ-102A = drill 3 pad 4.8: RING 0.1,-3.39; RING_SW -4.6,-6.29; TIP 0.1,-9.29
TSSOP16 = smd 0.35 x 1.2: 1 -2.275,-2.925; 2 -1.625,-2.925; 3 -0.975,-2.925; 4 -0.325,-2.925; 5 0.325,-2.925; 6 0.975,-2.925; 7 1.625,-2.925; 8 2.275,-2.925; 9 2.275,2.925; 10 1.625,2.925; 11 0.975,2.925; 12 0.325,2.925; 13 -0.325,2.925; 14 -0.975,2.925; 15 -1.625,2.925; 16 -2.275,2.925
UX60-MB-5S8 = smd 2 x 0.5: 1 8.65,1.6; 2 8.65,0.8; 3 8.65,0; 4 8.65,-0.8; 5 8.65,-1.6 | drill 0.8 long: M1 3.1,-3.65; M2 3.1,3.65; M3 8.4,3.65; M4 8.4,-3.65 | hole 0.9: 6.4,-1.75; 6.4,1.75

### Placement (x,y rotation side)
BATT_1  69.85,63.5 90 top
BATT_2  69.85,78.74 90 top
BATT_3  71.12,11.43 90 top
BATT_4  71.12,30.48 90 top
C1  129.54,38.42 90 top
C2  129.54,44.45 270 top
C3  80.64,62.87 0 bottom
C4  98.11,80.01 90 bottom
C5  26.67,56.52 270 top
C6  20.95,59.05 270 top
C7  91.76,39.05 270 top
C8  22.23,36.83 180 top
C9  85.09,63.5 270 bottom
C10  88.27,60.96 0 bottom
C11  24.45,61.91 180 top
C12  91.12,66.99 90 bottom
C13  101.28,43.81 180 top
C14  77.47,45.72 270 bottom
C15  80.96,52.39 270 bottom
C16  123.19,32.38 270 top
C17  120.65,36.83 270 top
C18  12.7,94.3 270 bottom
C19  10.16,94.61 270 bottom
C20  127.64,12.7 0 top
C21  127.95,16.19 0 top
C22  115.57,26.67 90 top
C23  86.36,52.07 270 top
C24  97.79,58.42 90 top
C25  116.84,14.61 270 bottom
C26  83.82,43.18 180 top
C27  105.09,40.01 180 top
C28  98.42,24.45 180 top
C29  20.95,44.45 270 top
C30  23.5,41.91 180 top
C33  94.3,42.86 90 top
C34  94.93,36.2 0 top
C37  9.53,47.31 270 bottom
C38  7.3,47.31 270 bottom
D1  35.56,82.55 90 top
D2  37.47,66.04 270 top
D3  34.29,31.75 90 top
D4  36.83,19.05 270 top
F1  52.7,83.19 90 top
F2  57.78,67.94 270 top
F3  119.38,14.61 270 bottom
F4  54.61,34.29 90 top
F5  59.69,16.51 270 top
H1  112.08,25.4 270 top
H2  109.54,25.4 270 top
H3  107,25.4 270 top
H4  104.46,25.4 270 top
H5  112.08,22.86 270 top
H6  109.54,22.86 270 top
H7  107,22.86 270 top
H8  104.46,22.86 270 top
IC5  120.65,17.78 270 top
ISP1  110.49,52.07 0 top
LED2  128.91,20.95 180 top
LED3  127,19.68 180 top
LOAD_1  7.62,76.2 270 top
LOAD_2  6.35,29.21 270 top
PC1  95.25,78.74 180 bottom
PC2  96.52,27.94 0 top
Q1  125.09,41.91 270 top
R1  46.99,57.15 90 top
R2  93.98,83.19 90 bottom
R3  127,26.04 90 top
R4  27.94,73.66 90 top
R5  26.04,66.04 270 top
R6  23.18,65.72 270 top
R7  96.52,20.95 0 top
R8  23.5,33.97 90 top
R9  124.46,26.04 90 top
R10  86.36,68.58 180 bottom
R11  86.36,66.04 180 bottom
R12  82.55,67.31 90 bottom
R14  46.99,93.98 270 top
R16  118.11,26.67 90 top
R17  104.46,29.21 90 top
R18  120.65,26.67 90 top
R19  101.92,49.53 180 bottom
R20  50.8,93.98 90 top
R21  52.07,57.15 90 top
R22  20.95,33.97 90 top
R23  25.4,25.4 90 top
R24  88.58,38.1 0 top
R25  88.58,40.64 0 top
R26  84.45,39.37 270 top
R29  107,29.21 90 top
R30  109.54,29.21 90 top
R31  112.08,29.21 90 top
R32  45.72,7.62 90 top
R33  46.67,43.5 270 bottom
R34  49.53,43.5 90 bottom
R35  50.8,7.62 90 top
T1  45.72,66.04 90 top
T2  46.99,83.82 270 top
T3  45.4,16.51 90 top
T4  46.99,34.29 270 top
T5  7.62,86.36 90 top
T6  5.4,40.01 90 top
T7  85.09,82.55 0 bottom
T8  87,22.86 180 top
T9  52.07,63.5 90 top
T10  50.48,88.27 270 bottom
T11  52.07,13.97 90 top
T12  50.8,38.1 270 bottom
U1  113.03,39.37 180 top
U2  24.13,59.05 90 top
U3  88.9,63.5 180 bottom
U4  5.08,93.98 0 bottom
U5  90.17,52.07 270 top
U6  106.05,46.35 270 top
U8  22.23,39.37 0 top
U9  95.25,38.73 180 top
U10  3.81,47.94 0 bottom
U$2  127.95,62.23 270 top
U$7  73.66,50.8 0 bottom
X1  121.92,0 90 top

### Tracks (layer width: path | path; a pad name or v marks a point on that pad's centre or on a via)
12V  (via drill 0.6)
  Top 0.406: 99.91,55.88 100.97,54.83 v100.97,52.07
  Top 0.61: v30.48,48.26 38.1,48.26 v40.64,50.8 | v53.98,50.8 57.15,53.98 76.83,53.98 v78.74,55.88
  Top 0.813: C24.1 97.79,55.88
  Top 1.016: U5.1 97.79,55.88 99.91,55.88 106.16,62.13 U$2.TIP
  Bottom 0.305: 7.09,47.94 C38.1
  Bottom 0.406: v100.97,52.07 101.07,51.97 R19.1
  Bottom 0.61: C18.1 12.48,95.47 C19.1 9.42,96.2 5.71,96.2 5.08,96.2 U4.3 1.91,92.95 1.91,50.1 U10.3 4.06,47.94 7.09,47.94 | C38.1 9.43,48.16 C37.1 13.97,48.26 v30.48,48.26 | v40.64,50.8 v53.98,50.8 | U5.1 v78.74,55.88
AREF
  Top 0.406: U1.20 106.55,39.77 C27.1
AVCC  (via drill 0.6)
  Top 0.305: 106.98,48.49 U6.1 | v84.14,46.35 85.72,46.35 86.36,45.72 v96.84,45.72
  Top 0.406: H8.1 H7.1 H6.1 H5.1 | C13.1 103.51,42.64 v106.68,42.64 107.05,42.27 | U1.18 107.95,41.37 107.05,42.27 | 106.98,47.42 U6.1 | U6.1 107.05,47.39 107.05,42.27 | v107,49.21 107,47.46 U6.1
  Bottom 0.305: U$7.2 75.28,46.95 75.88,46.35 77.05,46.35 C14.1 77.69,46.35 v84.14,46.35 84.03,46.25
  Bottom 0.406: H8.1 H7.1 H6.1 H5.1 110.81,24.13 110.81,28.57 111.44,29.21 111.44,40.32 110.49,41.27 108.05,41.27 v106.68,42.64 103.6,45.72 v96.84,45.72 | R19.2 106.68,49.53 v107,49.21
BATT+_1
  Top 0.61: R5.1 26.67,71.25 R4.1
  pour Top (isolate 0.305, rank 5): 25.4,66.67 25.4,82.55 44.45,82.55 44.45,66.67
BATT+_2
  Top 0.406: R23.2 23.5,29.52 R8.1
  Top 0.61: 24.13,21.72 R23.1
  pour Top (rank 5): 41.91,17.78 22.54,17.78 22.54,31.75 41.91,31.75
BATT_CONN_1_1
  Bottom 0.406: BATT_1.1 71.39,61.97 U$7.9
  pour Top (isolate 0.305, rank 4): 55.24,60.96 55.24,67.94 66.67,67.94 71.75,64.77 71.75,60.96
BATT_CONN_1_2  (via drill 0.6)
  Top 0.406: v73.03,45.72 73.03,40.01 v74.61,38.42
  Bottom 0.305: U$7.5 73.33,46.36 v73.03,45.72
  Bottom 0.406: BATT_3.1 74.61,14.92 v74.61,38.42
  pour Top (rank 5): 57.15,8.89 57.15,16.51 68.58,16.51 73.66,11.43 73.66,8.89
BATT_CONN_2_1
  Bottom 0.305: 72.69,65.06 72.71,65.09
  Bottom 0.406: 72.69,65.06 72.03,64.42 U$7.10
  Bottom 0.61: 72.71,65.09 72.71,75.88 BATT_2.1
  pour Top (isolate 0.305, rank 5): 51.44,90.17 51.44,74.93 71.75,74.93 71.75,80.01
BATT_CONN_2_2  (via drill 0.6)
  Top 0.305: v70.8,45.72 71.75,44.77 v71.75,40.96
  Bottom 0.305: U$7.6 72.69,46.97 71.44,45.72 v70.8,45.72
  Bottom 0.406: v71.75,40.96 73.34,39.37 73.34,32.7 BATT_4.1
  pour Top (rank 5): 73.66,27.94 53.34,27.94 53.34,39.37 60.96,39.37 60.96,36.83 73.66,31.75
BATT_EN_1_1  (via drill 0.6)
  Top 0.305: 46.99,58.42 R1.2 | U1.19 107.39,40.57 106.36,41.59 101.28,41.59 v100.97,41.91 | v85.41,45.09 95.57,45.09 96.2,44.45 v98.42,44.45
  Top 0.406: v73.34,49.53 75.88,49.53 v80.33,45.09
  Top 0.61: T1.G 46.99,62.23 R1.2 48.26,58.1 v48.9,57.47
  Bottom 0.305: v100.97,41.91 v98.42,44.45 | v80.33,45.09 v85.41,45.09
  Bottom 0.406: v48.9,57.47 64.45,57.47 72.39,49.53 v73.34,49.53
BATT_EN_1_2  (via drill 0.6)
  Top 0.406: T3.G 45.72,12.7 R32.2 44.77,8.57 44.13,7.94 44.13,5.4 45.72,3.81 84.14,3.81 v88.27,7.94 | v117.47,33.66 117.47,36.42 U1.1
  Bottom 0.406: v88.27,7.94 104.46,7.94 115.57,19.05 115.57,31.75 v117.47,33.66
BATT_EN_2_1  (via drill 0.6)
  Top 0.406: U1.11 114.23,46.28 117.16,49.21 v117.16,52.39
  Top 0.61: 46.99,90.17 96.52,90.17 v99.06,90.17
  Top 0.813: T2.G 46.99,90.17 R14.2
  Bottom 0.61: v117.16,52.39 117.16,55.24 111.44,60.96 111.44,77.79 v99.06,90.17
BATT_EN_2_2  (via drill 0.6)
  Top 0.406: v82.55,40.96 75.25,48.26 65.72,48.26 v64.45,49.53 | v94.61,34.61 105.09,34.61 107.86,37.37 U1.23
  Top 0.61: v44.45,45.72 v44.45,49.53
  Bottom 0.406: T4.G 46.99,42.23 R33.2 45.08,42.55 | v82.55,40.96 84.45,39.05 91.44,39.05 94.61,35.88 v94.61,34.61
  Bottom 0.61: 45.08,42.55 44.45,43.18 v44.45,45.72 | v44.45,49.53 v64.45,49.53
CHARGE_1_1  (via drill 0.6)
  Top 0.406: T9.1 51.13,59.04 R21.2 72.07,58.1 72.39,58.42 v73.66,58.42 | U1.13 112.63,46.59 114.3,48.26 v114.3,54.61
  Bottom 0.406: v114.3,54.61 110.17,58.74 73.98,58.74 v73.66,58.42
CHARGE_1_2  (via drill 0.6)
  Top 0.406: U1.32 115.83,33.08 v117.47,31.75
  Top 0.61: T11.1 51.13,8.9 | 51.13,8.9 R35.2 | 51.13,8.9 53.01,8.9 55.56,6.35 v77.47,6.35
  Bottom 0.406: v77.47,6.35 104.14,6.35 116.52,18.73 116.52,30.8 v117.47,31.75
CHARGE_2_1  (via drill 0.6, 0.8)
  Top 0.406: U1.10 115.03,46.13 118.43,49.53 v118.43,53.66
  Top 0.61: v50.8,91.44 96.52,91.44 v100.33,91.44
  Top 0.813: v50.8,91.44 R20.1
  Bottom 0.61: v118.43,53.66 118.43,55.56 112.39,61.59 112.39,79.38 v100.33,91.44
  Bottom 0.813: T10.1 49.54,90.18 v50.8,91.44
CHARGE_2_2  (via drill 0.6)
  Top 0.61: v101.6,38.17 U1.22
  Bottom 0.406: R34.1 50.8,42.55 52.7,44.45 73.98,44.45 75.88,42.55 97.22,42.55 v101.6,38.17
  Bottom 0.813: T12.1 49.86,42.22 R34.1
CHARGE_EN_1  (via drill 0.6)
  Top 0.406: U1.12 113.43,46.44 115.89,48.9 v115.89,51.12
  Bottom 0.61: v115.89,51.12 115.89,54.93 110.49,60.33 110.49,72.39 99.06,83.82 94.19,83.82 R2.2
CHARGE_EN_2  (via drill 0.6)
  Top 0.406: v105.41,32.7 106.36,32.7 111.76,38.1 114.62,38.1 115.35,37.37 U1.2 | R7.2 98.42,20.95 v99.06,21.59
  Bottom 0.61: v99.06,21.59 99.06,22.54 105.41,28.89 v105.41,32.7
CHARGE_MAIN_1  (via drill 0.6)
  Top 0.61: T9.2 53.01,61.29 54.61,59.69 71.12,59.69 v74.3,62.87
  Bottom 0.305: 96.2,79.37 95.89,79.06 91.12,79.06
  Bottom 0.406: C4.1 96.73,79.16 PC1.3 96.2,79.37 | 91.12,79.06 T7.P$15
  Bottom 0.61: T10.2 78.92,89.36 T7.P$6 | v74.3,62.87 80.64,69.22 T7.P$20
  pour Bottom: 91.44,78.74 78.74,78.74 78.74,88.9 91.44,88.9
  pour Top: 78.74,88.9 78.74,78.74 91.44,78.74 91.44,88.9
CHARGE_MAIN_2
  Top 0.305: PC2.3 97.47,27.31 97.16,27.62 94.3,27.62 T8.P$15
  Top 0.406: PC2.3 99.28,24.98 C28.1
  Top 0.813: 87.63,21.59 86.36,22.86
  Top 1.27: T11.2 58.27,7.62 76.2,7.62 82.55,13.97 T8.P$6
  Bottom 1.27: T12.2 51.74,40.31 54.61,43.18 73.03,43.18 81.92,34.29 81.92,26.04 T8.P$20
  pour Top (isolate 0.305): 92.71,26.67 92.71,16.51 81.28,16.51 81.28,26.67
  pour Bottom: 81.28,16.51 81.28,26.67 92.71,26.67 92.71,16.51
CHARGE_SENSE_1
  Bottom 0.406: U$7.11 72.69,59.03 73.34,59.69 88.37,59.69 89.11,60.44 C10.1 89.95,61.58 U3.6
CHARGE_SENSE_2  (via drill 0.6)
  Top 0.305: U9.6 94.21,36.32 C34.1 92.08,36.2 v90.81,36.83 | v78.74,40.96 v74.93,45.09
  Bottom 0.305: v90.81,36.83 82.87,36.83 v78.74,40.96 | U$7.4 73.98,46.35 v74.93,45.09
CS0  (via drill 0.6)
  Top 0.406: U1.14 111.83,41.98 v111.76,41.91 | v96.84,46.99 95.89,46.99 94.93,46.35 86.68,46.35 85.41,47.62 v83.19,47.62
  Bottom 0.305: v83.19,47.62 82.94,47.88 U$7.1
  Bottom 0.406: v111.76,41.91 109.22,41.91 104.46,46.67 97.16,46.67 v96.84,46.99
D+
  Top 0.406: X1.3 121.92,12.7 122.78,13.55 IC5.15
D-
  Top 0.406: X1.2 121.12,13.17 122.16,14.21 IC5.16
DISC_EN_1  (via drill 0.6)
  Top 0.406: U1.9 115.83,45.98 119.7,49.85 v119.7,54.93
  Top 0.61: v7.62,93.98 10.48,96.84 93.98,96.84 v97.79,96.84
  Bottom 0.61: U4.4 7.23,93.98 v7.62,93.98 | v119.7,54.93 119.7,55.88 113.35,62.23 113.35,81.28 v97.79,96.84
DISC_EN_2  (via drill 0.6)
  Top 0.406: v93.66,33.34 104.23,33.34 104.87,33.97 106.14,33.97 U1.24
  Top 0.61: v67.31,46.99 74.61,46.99 v80.64,40.96
  Bottom 0.61: U10.4 5.15,49.53 36.83,49.53 39.37,46.99 v67.31,46.99 | v80.64,40.96 83.5,38.1 91.12,38.1 93.03,36.2 93.03,33.97 v93.66,33.34
DISC_GATE_1
  Bottom 0.61: U4.2 3.81,92.46 3.81,84.45 4.45,83.82 T5.G 6.35,83.82
DISC_GATE_2
  Bottom 0.61: T6.G 3.17,37.47 2.54,38.1 2.54,46.42 U10.2
DISC_INV_1
  Top 0.305: R6.2 23.6,64.45 C11.2 24.13,61.38 U2.5
DISC_INV_2
  Top 0.305: R22.2 21.06,36.51 C8.2 22.23,37.68 22.23,39.05 22.54,39.37 U8.5
DISC_NON_INV_1
  Top 0.305: U2.4 24.79,61.41 C11.1 25.3,64.45 R5.2
DISC_NON_INV_2
  Top 0.305: R8.2 23.39,36.51 C8.1 23.07,38.52 U8.4
DTR
  Top 0.406: IC5.2 115.81,21.36 115.57,21.59 C22.1
FUSE_OUT_1_1
  pour Top (isolate 0.305, rank 2): 43.81,67.31 43.81,75.56 60.96,75.56 60.96,67.31
FUSE_OUT_1_2
  pour Top (rank 3): 62.23,17.14 62.23,25.4 42.23,25.4 42.23,17.14
FUSE_OUT_2_1
  pour Top (isolate 0.305, rank 4): 44.45,82.55 53.98,82.55 53.98,75.56 44.45,75.56
FUSE_OUT_2_2
  pour Top (rank 4): 55.88,33.66 55.88,25.4 41.91,25.4 41.91,33.66
GATE_1
  Bottom 0.305: PC1.4 96.2,78.11 95.89,78.42 92.39,78.42 T7.1
GATE_2
  Top 0.305: PC2.4 97.47,28.57 97.16,28.26 94.3,28.26 T8.1
GND  (via drill 0.6)
  Top 0.305: 121.92,18.41 122.88,17.45 IC5.21 126.06,17.45 | 122.56,15.88 122.92,15.51 IC5.18 125.47,15.51 125.73,15.24
  other vias: 120.65,31.75 119.38,31.75 120.65,33.02 119.38,33.02 91.12,60.01 92.71,60.01 94.3,60.01 95.89,60.01 85.72,60.96
  pour Bottom (isolate 0.305, rank 6): 0,0 132.72,0 132.72,99.06 0,99.06
  pour Top (isolate 0.254, rank 6): 132.72,0 132.72,99.06 0,99.06 0,0
I_SENSE_1  (via drill 0.6)
  Top 0.305: C6.1 21.15,60.1 U2.6 23.47,59.4 23.81,59.05 32.38,59.05 v35.56,55.88
  Bottom 0.305: 35.88,55.56 v35.56,55.88
  Bottom 0.406: 35.88,55.56 65.41,55.56 72.03,48.93 U$7.7
I_SENSE_2  (via drill 0.6)
  Top 0.305: U8.6 23.27,40.83 C30.1 35.56,41.91 v41.91,48.26
  Bottom 0.305: v41.91,48.26 42.3,47.88 U$7.8
INV_1
  Bottom 0.305: 87.21,69.01 R10.2 87.95,67.84 C12.2 92.39,66.57 92.39,64.77 91.12,63.5 U3.5 89.53,63.5
INV_2
  Top 0.305: R24.2 89.53,38.2 C7.2 92.29,38.73 U9.5
LOAD+_1  (via drill 0.6)
  Top 0.61: R6.1 21.59,72.34 R4.4
  other vias: 17.78,78.74 17.78,77.47 17.78,76.2 17.78,74.93 17.78,73.66 17.78,71.12 17.78,72.39 17.78,69.85 17.78,67.31 17.78,66.04 17.78,68.58 16.51,66.04 16.51,67.31 16.51,68.58 16.51,69.85 16.51,71.12 16.51,73.66 16.51,74.93 16.51,72.39 16.51,76.2 16.51,77.47 16.51,78.74 15.24,66.04 15.24,68.58 15.24,67.31 15.24,71.12 15.24,69.85 15.24,73.66 15.24,72.39 15.24,74.93 15.24,76.2 15.24,77.47 15.24,78.74
  pour Top (isolate 0.305, rank 2): 24.13,80.01 24.13,66.04 5.71,66.04 5.71,80.01
  pour Bottom: 24.45,66.04 24.45,80.01 5.08,80.01 5.08,66.04
LOAD+_2
  Top 0.406: R23.3 20.95,29.52 R22.1
  pour Top (rank 2): 22.23,17.78 22.23,31.75 3.81,31.75 3.81,17.78
M8RXD
  Top 0.406: R16.1 117.03,24.64 IC5.1
M8TXD
  Top 0.406: R18.1 120.65,20.32 119.73,19.41 IC5.5
MISO
  Top 0.406: U1.16 110.23,48 110.49,48.26 110.49,53.34 ISP1.1
  Bottom 0.305: ISP1.1 105.73,58.1 74.93,58.1 73.98,57.16 U$7.13
MOSI
  Top 0.406: U1.15 111.03,46.26 113.03,48.26 113.03,50.8 ISP1.4
  Bottom 0.305: ISP1.4 110.49,53.34 108.27,53.34 104.14,57.47 75.25,57.47 74.64,56.85 U$7.14
N$32
  Top 0.254: IC5.23 125.44,18.75 126.36,19.68 128.69,19.68 LED2.C
N$34
  Top 0.406: IC5.22 126.47,18.11 LED3.C
N$35
  Top 0.305: R3.1 128.91,23.18 LED2.A
N$36
  Top 0.305: R9.1 127,22.55 LED3.A
NMOS_IN_1
  pour Top (isolate 0.305): 13.97,71.12 13.97,81.28 11.43,81.28 11.43,87 5.71,87 5.71,74.93
NMOS_IN_2
  pour Top: 13.02,24.13 13.02,40.64 2.54,40.64 2.54,27.94
NON_INV_1
  Bottom 0.305: R11.2 91.02,66.04 C12.1 91.12,64.45 90.81,64.14 90.78,64.16 U3.4
NON_INV_2
  Top 0.305: U9.4 92.27,39.4 C7.1 91.02,40.64 R25.2
PMOS_OUT_1_1
  Top 0.305: D2.A 41.91,60.96
  Top 0.813: T1.D 50.62,66.04 T9.3
  pour Top (isolate 0.305, rank 3): 34.29,59.69 34.29,67.31 48.9,67.31 48.9,59.69
PMOS_OUT_1_2
  Top 0.406: T11.3 50.62,16.51 T3.D
  pour Top (rank 2): 47.94,17.78 34.29,17.78 34.29,11.43 47.94,11.43
PMOS_OUT_2_1
  Top 0.305: 40.96,86.68 40.64,86.36
  Bottom 0.61: T10.3 50.48,84.77 49.53,83.82 T2.D
  pour Top (isolate 0.305, rank 3): 33.02,82.55 33.02,88.9 49.53,88.9 49.53,82.55
PMOS_OUT_2_2
  Bottom 0.406: D3.A 34.47,34.29
  Bottom 0.813: T12.3 48.08,34.29 T4.D
  pour Top (rank 3): 49.53,31.75 31.75,31.75 31.75,39.37 49.53,39.37
RESET  (via drill 0.6)
  Top 0.406: v113.35,36.83 113.43,36.43 U1.29 113.43,31.35 115.57,29.21 C22.2 115.97,28.02
  Bottom 0.406: v113.35,36.83 113.35,46.99 112.39,47.94 110.81,47.94 ISP1.5
RX
  Top 0.406: R16.2 114.23,31.5 U1.30
SCK
  Top 0.406: U1.17 108.74,48.11 107.95,48.9 107.95,50.8 ISP1.3
  Bottom 0.305: U$7.16 75.94,53.66 78.42,53.66
  Bottom 0.406: ISP1.3 108.58,52.07 106.05,54.61 79.38,54.61 78.42,53.66
SHDN_1
  Bottom 0.305: PC1.1 94.3,82.02 R2.1
SHDN_2
  Top 0.406: PC2.1 95.57,21.05 R7.1
T_BATT_1
  Top 0.305: H1.1 113.35,27.94 113.35,29.21 112.5,30.06 R31.2
  Top 0.406: U1.28 112.63,30.61 R31.2
T_BATT_2
  Top 0.305: H2.1 110.81,27.94 110.81,29.21 109.96,30.06 R30.2
  Top 0.406: U1.27 111.83,32.35 R30.2
T_BATT_3
  Top 0.305: H3.1 108.27,27.94 108.27,29.21 107.42,30.06 R29.2
  Top 0.406: U1.26 111.03,34.09 R29.2
T_BATT_4
  Top 0.305: H4.1 105.73,27.94 105.73,29.21 104.88,30.06 R17.2
  Top 0.406: U1.25 105.21,30.06 R17.2
TX
  Top 0.406: R18.2 119.06,29.21 118.11,29.21 115.03,32.29 U1.31
USB_V_IN  (via drill 0.6)
  Top 0.305: X1.1 120.32,10.49 v119.38,11.43
  Bottom 0.305: v119.38,11.43 F3.2
V_SNS_1
  Bottom 0.305: R10.1 85.38,68.71 R12.2 84.58,68.71 | PC1.6 94.3,76.2
  Bottom 0.406: 94.3,76.2 94.3,75.25 88.9,69.85 83.69,69.85 R12.2
  Bottom 1.016: R12.2 82.78,68.94 82.78,71.44 T7.3
V_SNS_2
  Top 0.406: R24.1 85.09,38.1 | 85.09,38.1 84.58,38.1 R26.2 | 85.09,38.1 87.31,35.88 90.49,35.88 91.44,34.92 91.44,33.66 95.57,29.52 PC2.6
  Top 1.676: T8.3 R26.2
VCC  (via drill 0.6, 0.8, 1)
  Top 0.305: U1.4 115.97,38.97 115.57,39.37 115.57,40.01 116.2,40.64 117.25,40.64 U1.6 | IC5.4 118.48,20.05 v119.38,20.95 | 122.89,16.8 121.62,16.8 v121.28,17.14 | U2.3 24.79,57.55 | 46.67,55.88 R1.1 | R9.2 R3.2 127,28.57 v127.64,29.21 | U8.3 21.16,38.73 20.32,38.73 19.68,39.37 19.68,44.03 C29.1 | C26.1 84.99,43.5
  Top 0.406: U1.4 119.36,38.97 C17.1 | IC5.19 125.45,16.16 C21.1 | IC5.19 IC5.20 122.89,16.8 | C16.1 123.61,33.23 | 123.55,16.16 IC5.19 | R25.1 87.28,40.77 85.09,40.77 | 85.09,40.77 R26.1 | U9.3 95.89,40.44 v95.89,41.27 95.15,42.01 C33.1 86.33,42.01 85.09,40.77 | PC2.5 96.52,30.48 v95.25,32.07 | v44.45,57.15 46.67,55.88 | v76.52,55.56 75.88,56.2 R21.1 | 24.79,57.55 26.49,57.55 C5.1 30.27,57.37 v30.48,57.15 | C23.1 v83.82,53.02 | U5.2 91.76,53.34
  Top 0.61: U1.6 121.99,40.57 123.19,39.37 C16.1 | 123.61,33.23 v125.09,32.38 | R32.1 R35.1 52.39,5.08 82.55,5.08 v95.25,17.78 | R21.1 R1.1 46.99,49.85 v51.44,45.4 | C29.1 25.4,49.74 v25.4,52.07 | 53.02,94.93 93.03,94.93 v93.98,93.98 | 46.67,55.88 46.99,55.56 | 91.76,53.34 v95.25,49.85 | v90.17,43.81 89.53,43.18 C26.1
  Top 0.813: v115.57,41.91 115.57,41.27 116.2,40.64 | 53.02,94.93 R20.2 R14.1 | U5.2 87.63,53.34 | 87.63,53.34 C23.1 | C26.1 84.67,40.98 R26.1 | ISP1.2 110.17,56.2 107,56.2 105.09,54.61 v105.09,53.02 | v95.25,67.09 93.98,65.83 91.44,63.5 v83.19,63.5 83.19,60.96 87.63,56.51 87.63,53.34 | v95.25,74.93 v95.25,87.63
  Bottom 0.305: 117.29,16 C25.1 | 85.72,65.83 R11.1 85.38,65.91 R12.1 84.11,64.35 C9.1 85.28,64.16 U3.3 | 95.25,75.56 PC1.5 | 82.55,63.92 82.79,64.16 | 82.55,63.5 82.34,63.71
  Bottom 0.406: v30.48,57.15 v44.45,57.15 | v76.52,55.56 75.28,54.57 U$7.15 75.28,52.98 75.88,52.39 78.42,52.39 79.27,53.24 C15.1 81.18,53.02 v83.82,53.02 | 95.25,75.56 v95.25,74.93
  Bottom 0.61: v125.09,32.38 v127.64,29.21 v119.38,20.95 119.38,19.05 | 117.29,16 F3.1 119.38,19.05 | R33.1 R34.2 50.48,44.45 v51.44,45.4 | v95.25,17.78 v95.25,32.07 97.79,34.61 97.79,39.37 v95.89,41.27 | v121.28,17.14 119.38,19.05 | v25.4,52.07 v30.48,57.15 | v93.98,93.98 95.25,92.71 v95.25,87.63 | v95.25,49.85 95.25,44.77 93.98,43.5 90.49,43.5 v90.17,43.81
  Bottom 0.813: C3.1 82.34,63.71 82.55,63.92 R12.1 | v83.19,63.5 82.55,63.5 | ISP1.2 113.67,52.7 113.67,50.48 115.57,48.58 v115.57,41.91 | v105.09,53.02 104.14,53.34 U5.2 | v95.25,67.09 v95.25,74.93
VCC3O
  Top 0.305: IC5.17 125.17,14.86 126.69,13.34 C20.1
XTAL1
  Top 0.305: 125.73,39.3 126.36,37.39 Q1.2 128.84,37.08 C1.1
  Top 0.406: U1.7 123.73,41.37 125.73,39.37 125.73,39.3
XTAL2
  Top 0.305: 123.38,42.17 126.36,46.43 Q1.1 128.52,46.74 C2.1
  Top 0.406: U1.8 123.38,42.17

### Text on the board
tPlace: thermistor | Schematic & Layout: / Nick Mah / nickjmah@gmail.com